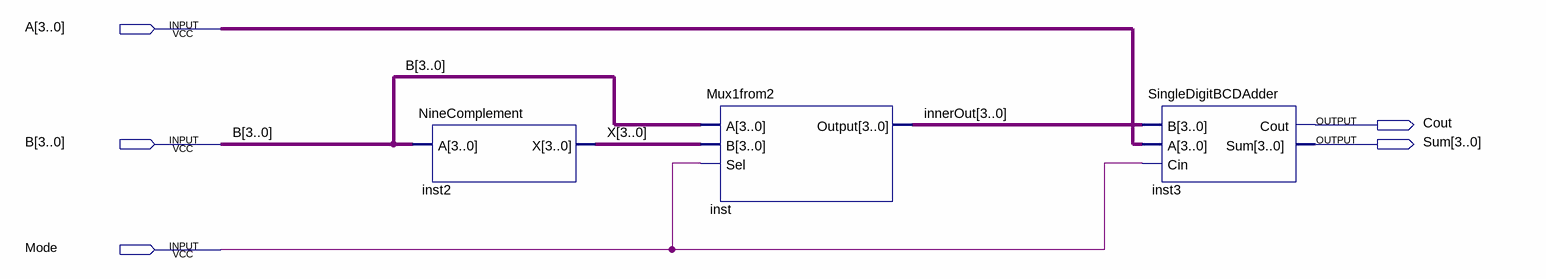
[diagram p0: schematic sheet]
// Quartus schematic SingleDigitBCDAdderSubtractor.bdf as structural Verilog: 3 symbols, 5 pins
module SingleDigitBCDAdderSubtractor (
  input  [3:0] A,
  input  [3:0] B,
  input  Mode,
  output Cout,
  output [3:0] Sum
);

  wire [3:0] innerOut, X;

  NineComplement inst2 (.A(B), .X(X));
  Mux1from2 inst (.A(B), .B(X), .Sel(Mode), .Output(innerOut));
  SingleDigitBCDAdder inst3 (.B(innerOut), .A(A), .Cin(Mode), .Cout(Cout), .Sum(Sum));
endmodule
